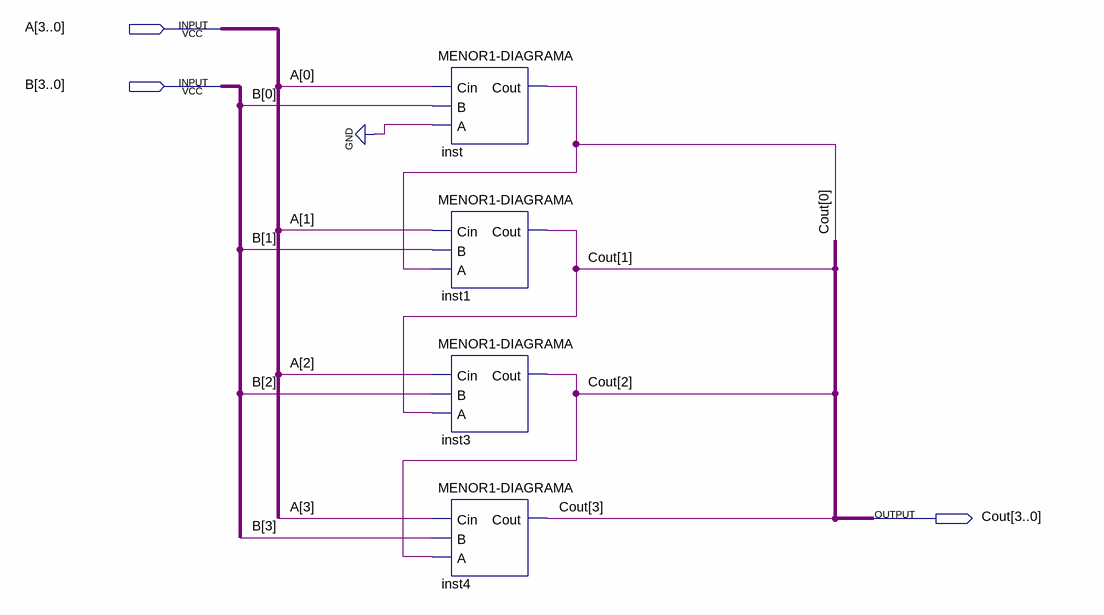
[diagram p0: schematic sheet]
// Quartus schematic MENOR4-DIAGRAMA.bdf as structural Verilog: 4 symbols, 3 pins
module \MENOR4-DIAGRAMA  (
  input  [3:0] A,
  input  [3:0] B,
  output [3:0] Cout
);

  \MENOR1-DIAGRAMA  inst (.Cin(A[0]), .B(B[0]), .A(1'b0), .Cout(Cout[0]));
  \MENOR1-DIAGRAMA  inst1 (.Cin(A[1]), .B(B[1]), .A(Cout[0]), .Cout(Cout[1]));
  \MENOR1-DIAGRAMA  inst3 (.Cin(A[2]), .B(B[2]), .A(Cout[1]), .Cout(Cout[2]));
  \MENOR1-DIAGRAMA  inst4 (.Cin(A[3]), .B(B[3]), .A(Cout[2]), .Cout(Cout[3]));
endmodule
